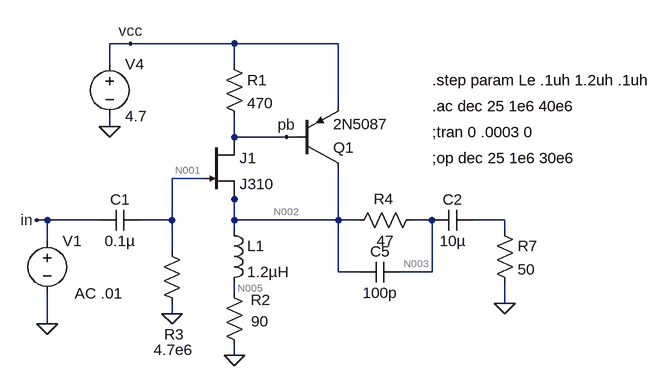
[diagram p0: schematic Draft1.asc]
Draft1.asc, the LTspice schematic file:
Version 4
SHEET 1 1056 680
WIRE 16 16 -16 16
WIRE 176 16 16 16
WIRE 336 16 176 16
WIRE -16 48 -16 16
WIRE 176 48 176 16
WIRE 336 112 336 16
WIRE -16 144 -16 128
WIRE 176 160 176 128
WIRE 256 160 176 160
WIRE 272 160 256 160
WIRE 128 224 80 224
WIRE 176 256 176 240
WIRE -112 288 -128 288
WIRE -32 288 -112 288
WIRE 80 288 80 224
WIRE 80 288 32 288
WIRE 176 288 176 256
WIRE 336 288 336 208
WIRE 336 288 176 288
WIRE 368 288 336 288
WIRE 480 288 448 288
WIRE 592 288 544 288
WIRE 176 304 176 288
WIRE 592 304 592 288
WIRE -112 320 -112 288
WIRE 80 336 80 288
WIRE 336 368 336 288
WIRE 368 368 336 368
WIRE 480 368 480 288
WIRE 480 368 432 368
WIRE 176 400 176 384
WIRE 592 416 592 384
WIRE 80 432 80 416
WIRE -112 448 -112 400
WIRE 176 496 176 480
FLAG -16 144 0
FLAG 176 496 0
FLAG -128 288 in
FLAG 16 16 vcc
FLAG 256 160 pb
FLAG 80 432 0
FLAG 592 416 0
FLAG -112 448 0
SYMBOL res 160 32 R0
SYMATTR InstName R1
SYMATTR Value 470
SYMATTR SpiceLine tol=1 pwr=0.1
SYMBOL res 160 384 R0
WINDOW 0 41 27 Left 2
WINDOW 3 42 60 Left 2
SYMATTR InstName R2
SYMATTR Value 90
SYMATTR SpiceLine tol=1 pwr=0.1
SYMBOL voltage -112 304 R0
WINDOW 3 24 44 Left 2
WINDOW 123 42 97 Left 2
WINDOW 39 24 44 Left 2
SYMATTR Value ""
SYMATTR Value2 AC .01
SYMATTR InstName V1
SYMBOL njf 128 160 R0
SYMATTR InstName J1
SYMATTR Value J310
SYMBOL voltage -16 32 R0
WINDOW 123 0 0 Left 0
WINDOW 39 24 124 Left 2
SYMATTR InstName V4
SYMATTR Value 4.7
SYMBOL res 64 320 R0
WINDOW 0 4 144 Left 2
WINDOW 3 -12 168 Left 2
SYMATTR InstName R3
SYMATTR Value 4.7e6
SYMBOL cap 32 272 R90
WINDOW 0 0 32 VBottom 2
WINDOW 3 32 32 VTop 2
SYMATTR InstName C1
SYMATTR Value 0.1µ
SYMATTR SpiceLine V=4 Irms=0 Rser=0 Lser=0 mfg="Murata" pn="GRM011R60G103KE01" type="X5R"
SYMBOL cap 544 272 R90
WINDOW 0 0 32 VBottom 2
WINDOW 3 32 32 VTop 2
SYMATTR InstName C2
SYMATTR Value 10µ
SYMBOL pnp 272 208 M180
SYMATTR InstName Q1
SYMATTR Value 2N5087
SYMBOL res 464 272 R90
WINDOW 0 -1 58 VBottom 2
WINDOW 3 32 56 VTop 2
SYMATTR InstName R4
SYMATTR Value 47
SYMBOL ind 160 288 R0
SYMATTR InstName L1
SYMATTR Value 1.2µH
SYMBOL cap 432 352 R90
WINDOW 0 0 32 VBottom 2
WINDOW 3 32 32 VTop 2
SYMATTR InstName C5
SYMATTR Value 100p
SYMBOL res 576 288 R0
SYMATTR InstName R7
SYMATTR Value 50
TEXT 480 192 Left 2 !;op dec 25 1e6 30e6
TEXT 480 112 Left 2 !.ac dec 25 1e6 40e6
TEXT 480 152 Left 2 !;tran 0 .0003 0
TEXT 480 72 Left 2 !.step param Le .1uh 1.2uh .1uh

The netlist it stands for:
* Draft1.asc
R1 vcc pb 470 tol=1 pwr=0.1
R2 N005 0 90 tol=1 pwr=0.1
V1 in 0 AC .01
J1 pb N001 N002 J310
V4 vcc 0 4.7
R3 N001 0 4.7e6
C1 N001 in 0.1µ V=4 Irms=0 Rser=0 Lser=0 mfg="Murata" pn="GRM011R60G103KE01" type="X5R"
C2 N004 N003 10µ
Q1 N002 pb vcc 0 2N5087
R4 N003 N002 47
L1 N002 N005 1.2µH
C5 N003 N002 100p
R7 N004 0 50
.model NPN NPN
.model PNP PNP
.lib standard.bjt
.model NJF NJF
.model PJF PJF
.lib standard.jft
;op dec 25 1e6 30e6
.ac dec 25 1e6 40e6
;tran 0 .0003 0
.step param Le .1uh 1.2uh .1uh
.backanno
.end

* Results of the author's LTspice run, read from the files saved beside the schematic
* Operating Point (first step), zero values left out:
*   le = 100 n
*   V(vcc) = 4.7 V
*   V(pb) = 3.944 V
*   V(n005) = 2.699 V
*   V(n001) = 67.88 µV
*   V(n002) = 2.699 V
*   V(n003) = 2.699 V
*   Ic(Q1) = -28.26 mA
*   Ib(Q1) = -123.7 µA
*   Ie(Q1) = 28.39 mA
*   I(L1) = 29.99 mA
*   Id(J1) = 1.732 mA
*   Ig(J1) = -14.44 pA
*   Is(J1) = -1.732 mA
*   I(R3) = 14.44 pA
*   I(R2) = 29.99 mA
*   I(R1) = 1.608 mA
*   I(V4) = -29.99 mA
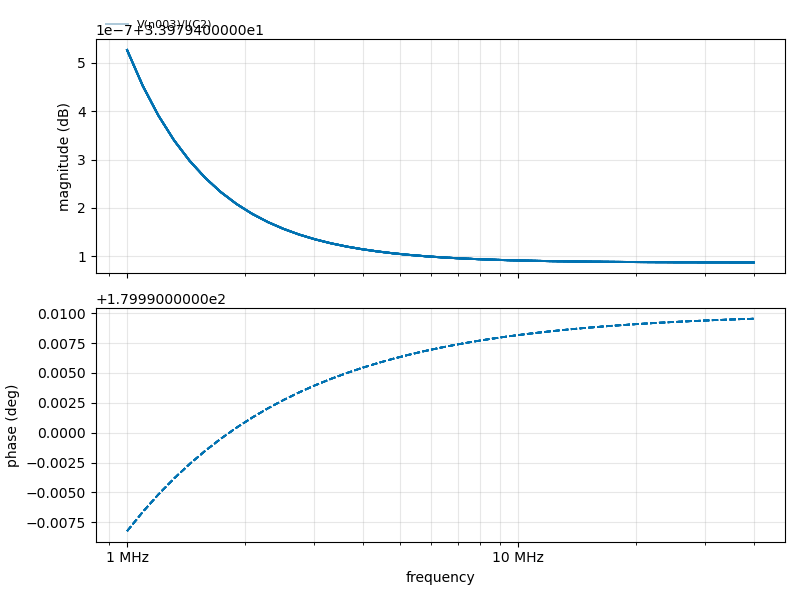
[diagram p1: AC Analysis of Draft1.asc, plotted from the saved traces]
* AC Analysis, 12 runs:
*   V(n003)/I(C2) [run 1]: 33.98 dB at 1 MHz, 33.98 dB at 40 MHz, peak 33.98 dB at 1 MHz
*   V(n003)/I(C2) [run 2]: 33.98 dB at 1 MHz, 33.98 dB at 40 MHz, peak 33.98 dB at 1 MHz
*   V(n003)/I(C2) [run 3]: 33.98 dB at 1 MHz, 33.98 dB at 40 MHz, peak 33.98 dB at 1 MHz
*   V(n003)/I(C2) [run 4]: 33.98 dB at 1 MHz, 33.98 dB at 40 MHz, peak 33.98 dB at 1 MHz
*   V(n003)/I(C2) [run 5]: 33.98 dB at 1 MHz, 33.98 dB at 40 MHz, peak 33.98 dB at 1 MHz
*   V(n003)/I(C2) [run 6]: 33.98 dB at 1 MHz, 33.98 dB at 40 MHz, peak 33.98 dB at 1 MHz
*   V(n003)/I(C2) [run 7]: 33.98 dB at 1 MHz, 33.98 dB at 40 MHz, peak 33.98 dB at 1 MHz
*   V(n003)/I(C2) [run 8]: 33.98 dB at 1 MHz, 33.98 dB at 40 MHz, peak 33.98 dB at 1 MHz